# Altium project MHE_Tracker_V1.PrjPcb
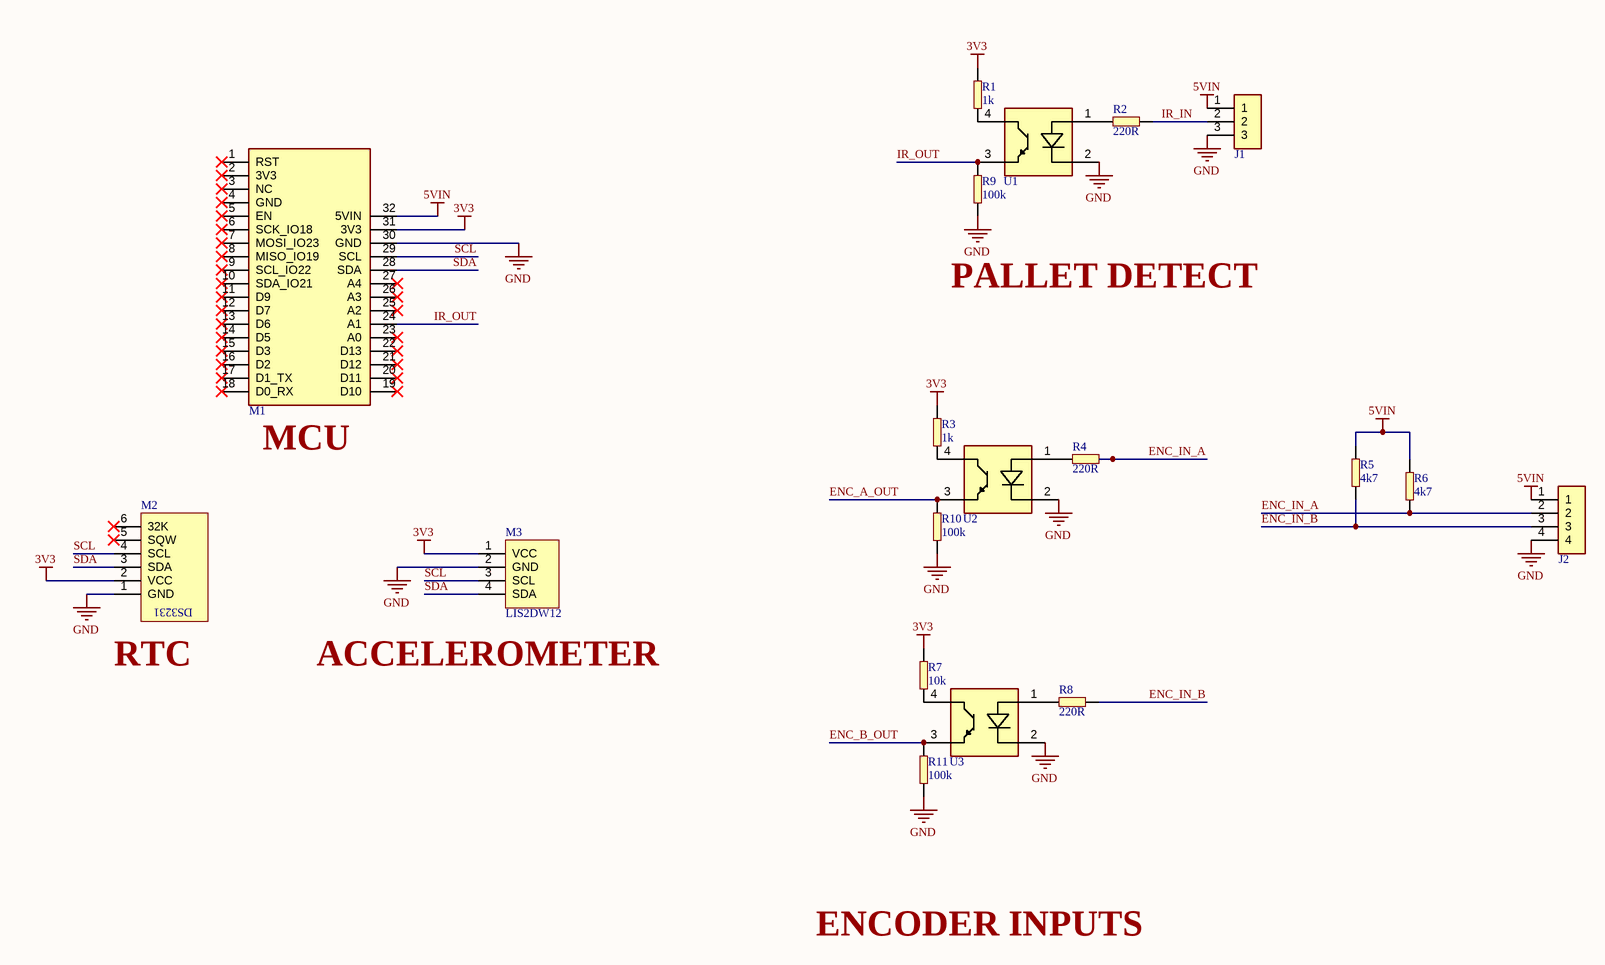
[diagram p0: Controller.SchDoc]
Revision: 1.0; SheetTotal: 4
2 sheets, 27 parts. Net scope: global (net labels, ports and power ports of the same name join across sheets).
Board file: MHE_Tracker_V1.PcbDoc
Sheets:
  Controller.SchDoc
  PowerSection.SchDoc

## Sheet Controller.SchDoc: Controller Section
size 420 x 297 mm; SheetNumber: 2

### Parts
J1  Terminal_Block_3Pin_2.54P  [Terminal_Block_3Pin_2.54P]  (value not drawn)
J2  Terminal_Block_4Pin_2.54P  [Terminal_Block_4Pin_2.54P]  (value not drawn)
M1  FireBeetle_32E  [DFR0654]  (value not drawn)
M2  DS3231_HW-084  [DS3231_HW-084]  (value not drawn)
M3  value LIS2DW12  [SEN0409]  (hidden comment: SEN0409)
R1  value 1k  [RES_0603]  (hidden comment: ERP_101-1)
R2  value 220R  [RES_0603]  (hidden comment: ERP_101-1)
R3  value 1k  [RES_0603]  (hidden comment: ERP_101-1)
R4  value 220R  [RES_0603]  (hidden comment: ERP_101-1)
R5  value 4k7  [RES_0603]  (hidden comment: ERP_101-1)
R6  value 4k7  [RES_0603]  (hidden comment: ERP_101-1)
R7  value 10k  [RES_0603]  (hidden comment: ERP_101-1)
R8  value 220R  [RES_0603]  (hidden comment: ERP_101-1)
R9  value 100k  [RES_0603]  (hidden comment: ERP_101-1)
R10  value 100k  [RES_0603]  (hidden comment: ERP_101-1)
R11  value 100k  [RES_0603]  (hidden comment: ERP_101-1)
U1  PC817_DIP  [PC817_DIP]  (value not drawn)
U2  PC817_DIP  [PC817_DIP]  (value not drawn)
U3  PC817_DIP  [PC817_DIP]  (value not drawn)

### Nets
3V3: M1.31(3V3) M2.2(VCC) M3.1(VCC) R1.2 R3.2 R7.2
5VIN: J1.1 J2.1 M1.32(5VIN) R5.2 R6.2
GND: J1.3 J2.4 M1.30(GND) M2.1(GND) M3.2(GND) R9.1 R10.1 R11.1 U1.2(CATHODE) U2.2(CATHODE) U3.2(CATHODE)
ENC_A_OUT: R10.2 U2.3(EMITTER)
ENC_B_OUT: R11.2 U3.3(EMITTER)
ENC_IN_A: J2.2 R4.2 R6.1
ENC_IN_B: J2.3 R5.1 R8.2
IR_IN: J1.2 R2.2
IR_OUT: M1.24(A1) R9.2 U1.3(EMITTER)
SCL: M1.29(SCL) M2.4(SCL) M3.3(SCL)
SDA: M1.28(SDA) M2.3(SDA) M3.4(SDA)
NetR1_1: R1.1 U1.4(COLLECTOR)
NetR2_1: R2.1 U1.1(ANODE)
NetR3_1: R3.1 U2.4(COLLECTOR)
NetR4_1: R4.1 U2.1(ANODE)
NetR7_1: R7.1 U3.4(COLLECTOR)
NetR8_1: R8.1 U3.1(ANODE)

Not connected (* = marked no-connect by the designer): M1 1(RST)* 2(3V3)* 3(NC)* 4(GND)* 5(EN)* 6(SCK_IO18)* 7(MOSI_IO23)* 8(MISO_IO19)* 9(SCL_IO22)* 10(SDA_IO21)* 11(D9)* 12(D7)* 13(D6)* 14(D5)* 15(D3)* 16(D2)* 17(D1_TX)* 18(D0_RX)* 19(D10)* 20(D11)* 21(D12)* 22(D13)* 23(A0)* 25(A2)* 26(A3)* 27(A4)*; M2 5(SQW)* 6(32K)*

### Notes on the sheet
- PALLET DETECT
- (near M1) MCU
- (near M2) RTC
- (near M3) ACCELEROMETER
- ENCODER INPUTS
- PROJECT
- SIZE
- FILE NAME
- A3
- TITLE
- SHEET
- OF
- REV
- (in symbol DS3231_HW-084) DS3231

### Library data of the parts
J1 = Terminal_Block_3Pin_2.54P: TERMINAL BLOCK 3 PIN 2.54 PITCH; Manufacturer Part Number 1: *; Manufacturer 1: *; Value: *
J2 = Terminal_Block_4Pin_2.54P: TERMINAL BLOCK 4 PIN 2.54 PITCH; Manufacturer Part Number 1: *; Manufacturer 1: *; Value: *
M1 = FireBeetle_32E: FIREBEETLE ESP32-E IOT MICROCONT; Manufacturer: DFRobot; Manufacturer Part Number 1: DFR0654; Value: *
M2 = DS3231_HW-084: DS3231 Time Module , HW-084; Manufacturer 1: Generic; Manufacturer Part Number 1: HW-084(DS3231); Package: 6 Pin TH; ERP: *; Supplier 1: *; Supplier Part Number 1: *; Value: HW-084
M3 = SEN0409: GRAVITY LIS2DW12 ACCELEROMETER; Manufacturer 1: DFRobot; Manufacturer Part Number 1: SEN0409
R1-R11 = RES_0603: Manufacturer 1: YAGEO; Manufacturer Part Number 1: RC0603FR-071KL; Package: 0603; ERP: *
U1-U3 = PC817_DIP: DIP-4 Transistor Output Optocoupler; Value: *; Manufacturer: *; Manufacturer Part Number 1: *

## Sheet PowerSection.SchDoc: Power Section
size 420 x 297 mm; SheetNumber: 3
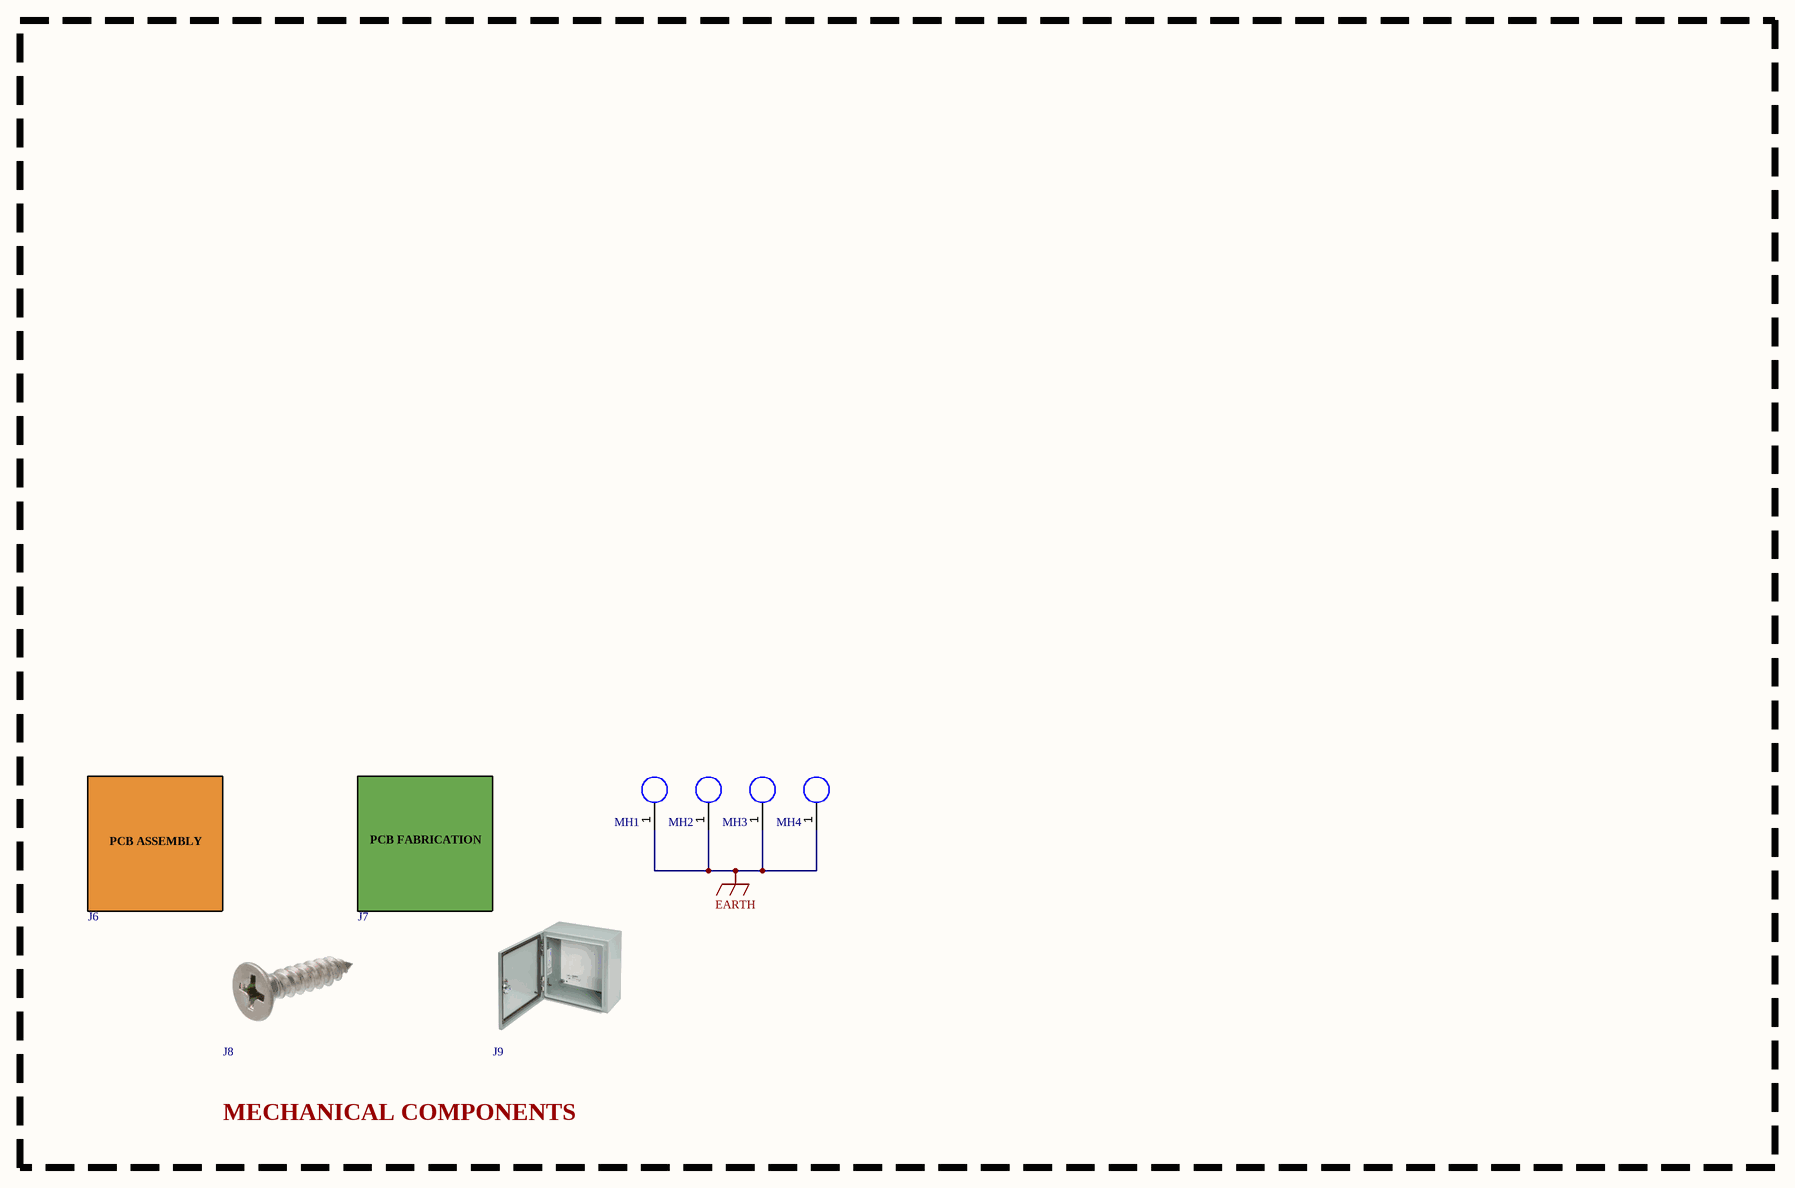
[diagram p1: PowerSection.SchDoc]

### Parts
J6  APCB  (value not drawn)  (graphical)
J7  BPCB  (value not drawn)  (graphical)
J8  SCREW  (value not drawn)  (graphical)
J9  ENCLOSURE  (value not drawn)  (graphical)
MH1  MountingHole4X6  [MountingHole4X6]  (value not drawn)  (no BOM)
MH2  MountingHole4X6  [MountingHole4X6]  (value not drawn)  (no BOM)
MH3  MountingHole4X6  [MountingHole4X6]  (value not drawn)  (no BOM)
MH4  MountingHole4X6  [MountingHole4X6]  (value not drawn)  (no BOM)

### Blocks framed on the sheet
MECHANICAL COMPONENTS: J6-J9 MH1-MH4

### Nets
EARTH: MH1.1 MH2.1 MH3.1 MH4.1

### Notes on the sheet
- PROJECT
- SIZE
- FILE NAME
- A3
- TITLE
- SHEET
- OF
- REV
- (in symbol APCB) PCB ASSEMBLY
- (in symbol BPCB) PCB FABRICATION

### Library data of the parts
J6 = APCB: Assembled PCB; Value: *; Manufacturer 1: *; Manufacturer Part Number 1: *
J7 = BPCB: Bare PCB; Manufacturer Part Number 1: *; Manufacturer 1: *; Value: *
J8 = SCREW: Mounting Screw
J9 = ENCLOSURE: PCB Enclosure; Manufacturer Part Number 1: *; Manufacturer 1: *; Value: *